# Altium schematic sheet [06] - SENSORS.SchDoc
size A4
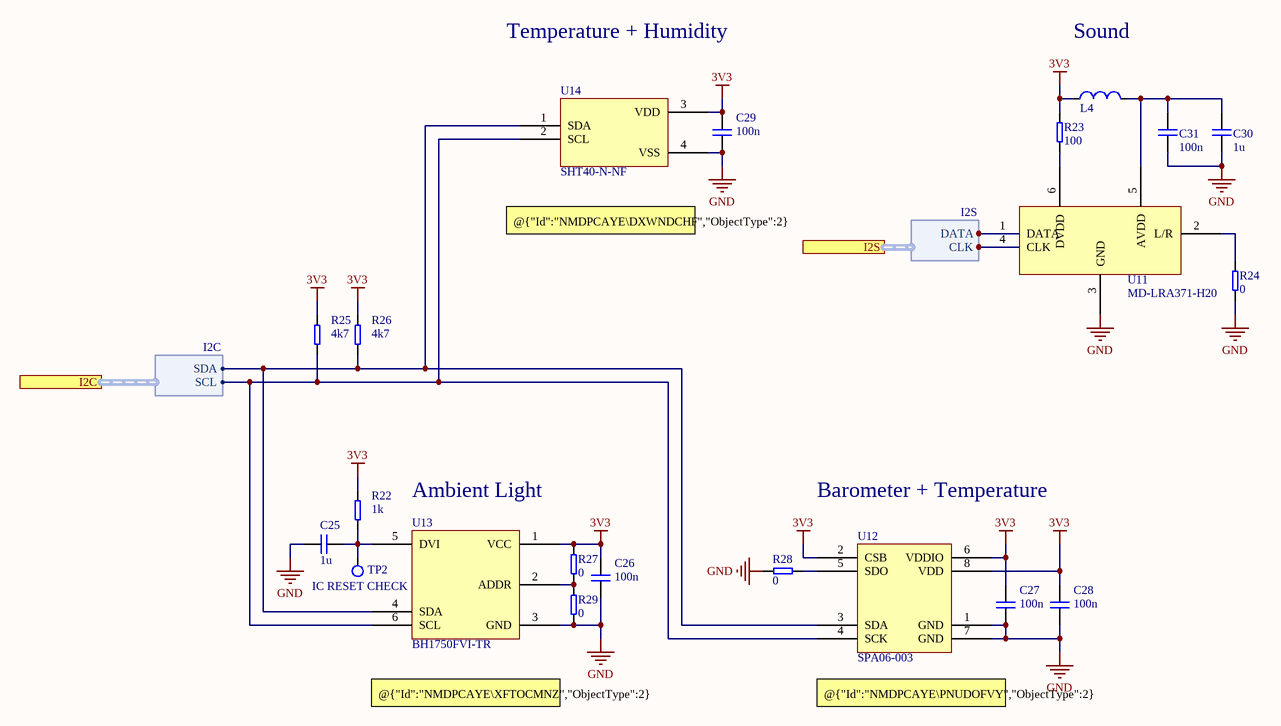
[diagram p0: [06] - SENSORS.SchDoc]

## Parts
C25  1u  [C0603]
C26  100n  [C0603]
C27  100n  [C0603]
C28  100n  [C0603]
C29  100n  [C0603]
C30  1u  [C0603]
C31  100n  [C0603]
L4  (no value)  [C0805]
R22  1k  [R0603]
R23  100  [R0603]
R24  0  [R0603]
R25  4k7  [R0603]
R26  4k7  [R0603]
R27  0  [R0603]
R28  0  [R0603]
R29  0  [R0603]
TP2  Test Point Name: IC RESET CHECK  [Test Point 1.6 mm]  (hidden comment: Test Point)  (no BOM)
U11  MD-LRA371-H20  [MD-LRA371-H20]
U12  SPA06-003  [SPA06-003]
U13  BH1750FVI-TR  [BH1750FVI-TR]
U14  SHT40-N-NF  [SHT40-N-NF]

## Ports
I2C (harness I2C), I2S (harness I2S)

## Harnesses
I2C: SDA, SCL
I2S: DATA, CLK

## Nets
3V3: C26.2 C27.2 C28.2 C29.2 L4.1 R22.2 R23.2 R25.2 R26.2 R27.2 U12.2(CSB) U12.6(VDDIO) U12.8(VDD) U13.1(VCC) U14.3(VDD)
GND: C25.2 C26.1 C27.1 C28.1 C29.1 C30.2 C31.1 R24.1 R28.1 R29.1 U11.3(GND) U12.1(GND) U12.7(GND) U13.3(GND) U14.4(VSS)
NetC25_1: C25.1 R22.1 TP2.1 U13.5(DVI)
NetC30_1: C30.1 C31.2 L4.2 U11.5(AVDD)
NetR23_1: R23.1 U11.6(DVDD)
NetR24_2: R24.2 U11.2(L/R)
NetR25_1: R25.1 U12.4(SCK) U13.6(SCL) U14.2(SCL) ; port I2C.SCL
NetR26_1: R26.1 U12.3(SDA) U13.4(SDA) U14.1(SDA) ; port I2C.SDA
NetR27_1: R27.1 R29.2 U13.2(ADDR)
NetR28_2: R28.2 U12.5(SDO)
NetU11_1: U11.1(DATA) ; port I2S.DATA
NetU11_4: U11.4(CLK) ; port I2S.CLK

## Notes on the sheet
- Temperature + Humidity
- Sound
- @{"Id":"NMDPCAYE\DXWNDCHF","ObjectType":2} I2C ADDRESS: “ 0x44“
- Ambient Light
- Barometer + Temperature
- @{"Id":"NMDPCAYE\XFTOCMNZ","ObjectType":2} I2C ADDRESS: “0100011“
- (near U12) @{"Id":"NMDPCAYE\PNUDOFVY","ObjectType":2} I2C ADDRESS: “ 0x77“

## Library data of the parts
C25-C31 = Cap: CAPACITOR
  C25 C30: Value: 1u
  C26-C29 C31: Value: 100n
L4 = Ind: Ferrite Bead; P/N: blm21pg221s
R22-R29 = Res: RESISTOR
  R22: Value: 1k
  R23: Value: 100
  R24 R27-R29: Value: 0
  R25 R26: Value: 4k7
U11 = MD-LRA371-H20: Omnidirectional -37dB 65dB SMD Microphones RoHS; Manufacturer: Gettop; HelpURL: https://www.lcsc.com/datasheet/C50275770.pdf?spm=wm.sxq.inf.ggs___wm.fly.bg.3.xh&lcsc_vid=FFBYBlcEFAQLVVJeQARWBFACRFUNUlFXRVlWBQJRRFkxVlNeR1RWXldUQ1RdUTsOAxUeFF5JWBYZEEoKFBINSQcJGk4eFQsCAgIaSgADAwAHC0slQldbUVJXR08GEwkK; P/N: MD-LRA371-H20
U12 = SPA06-003: LGA-8(2x2.5) Digital pressure sensor; Manufacturer: Goertek; HelpURL: https://www.lcsc.com/datasheet/C30589048.pdf?spm=wm.sxq.inf.ggs&lcsc_vid=EQRaUgBURlNYUgcERQILVVIEQ1gIVldeRllcAwAFQQMxVlNeR1RWU1JeQFRdUjsOAxUeFF5JWBYZEEoBGA4JCwFIFA4DSA%3D%3D; P/N: SPA06-003
U13 = BH1750FVI-TR: WSOF-6 Ambient Light Sensor IC; Manufacturer: ROHM; HelpURL: https://www.lcsc.com/datasheet/C78960.pdf?spm=wm.sxq.inf.ggs___wm.fly.bg.0.xh&lcsc_vid=FFBYBlcEFAQLVVJeQARWBFACRFUNUlFXRVlWBQJRRFkxVlNeR1RWUFZeRlheVTsOAxUeFF5JWBYZEEoKFBINSQcJGk4NBhADEA4cHktXQ1VaSQwSGg0%3D; P/N: BH1750FVI-TR
U14 = SHT40-N-NF: DFN-4(1.5x1.5) Humidity, Moisture Sensors RoHS; Manufacturer: Nyfea; HelpURL: https://www.lcsc.com/datasheet/C54946589.pdf?spm=wm.sxq.inf.ggs___wm.fly.bg.0.xh&lcsc_vid=FFBYBlcEFAQLVVJeQARWBFACRFUNUlFXRVlWBQJRRFkxVlNeR1RWVVxXRlddVTsOAxUeFF5JWBYZEEoKFBINSQcJGk4dAgUUFAk%3D; P/N: SHT40-N-NF